# EasyEDA schematic EasyEDA_esp8266-ed_fan_2020-07-05_01-05-03.json
TITLE: Sheet_1; REV: 1.0; Date: 2020-06-21; Sheet: 1/1; Drawn By: TurtleForGaming; Company: Your Company
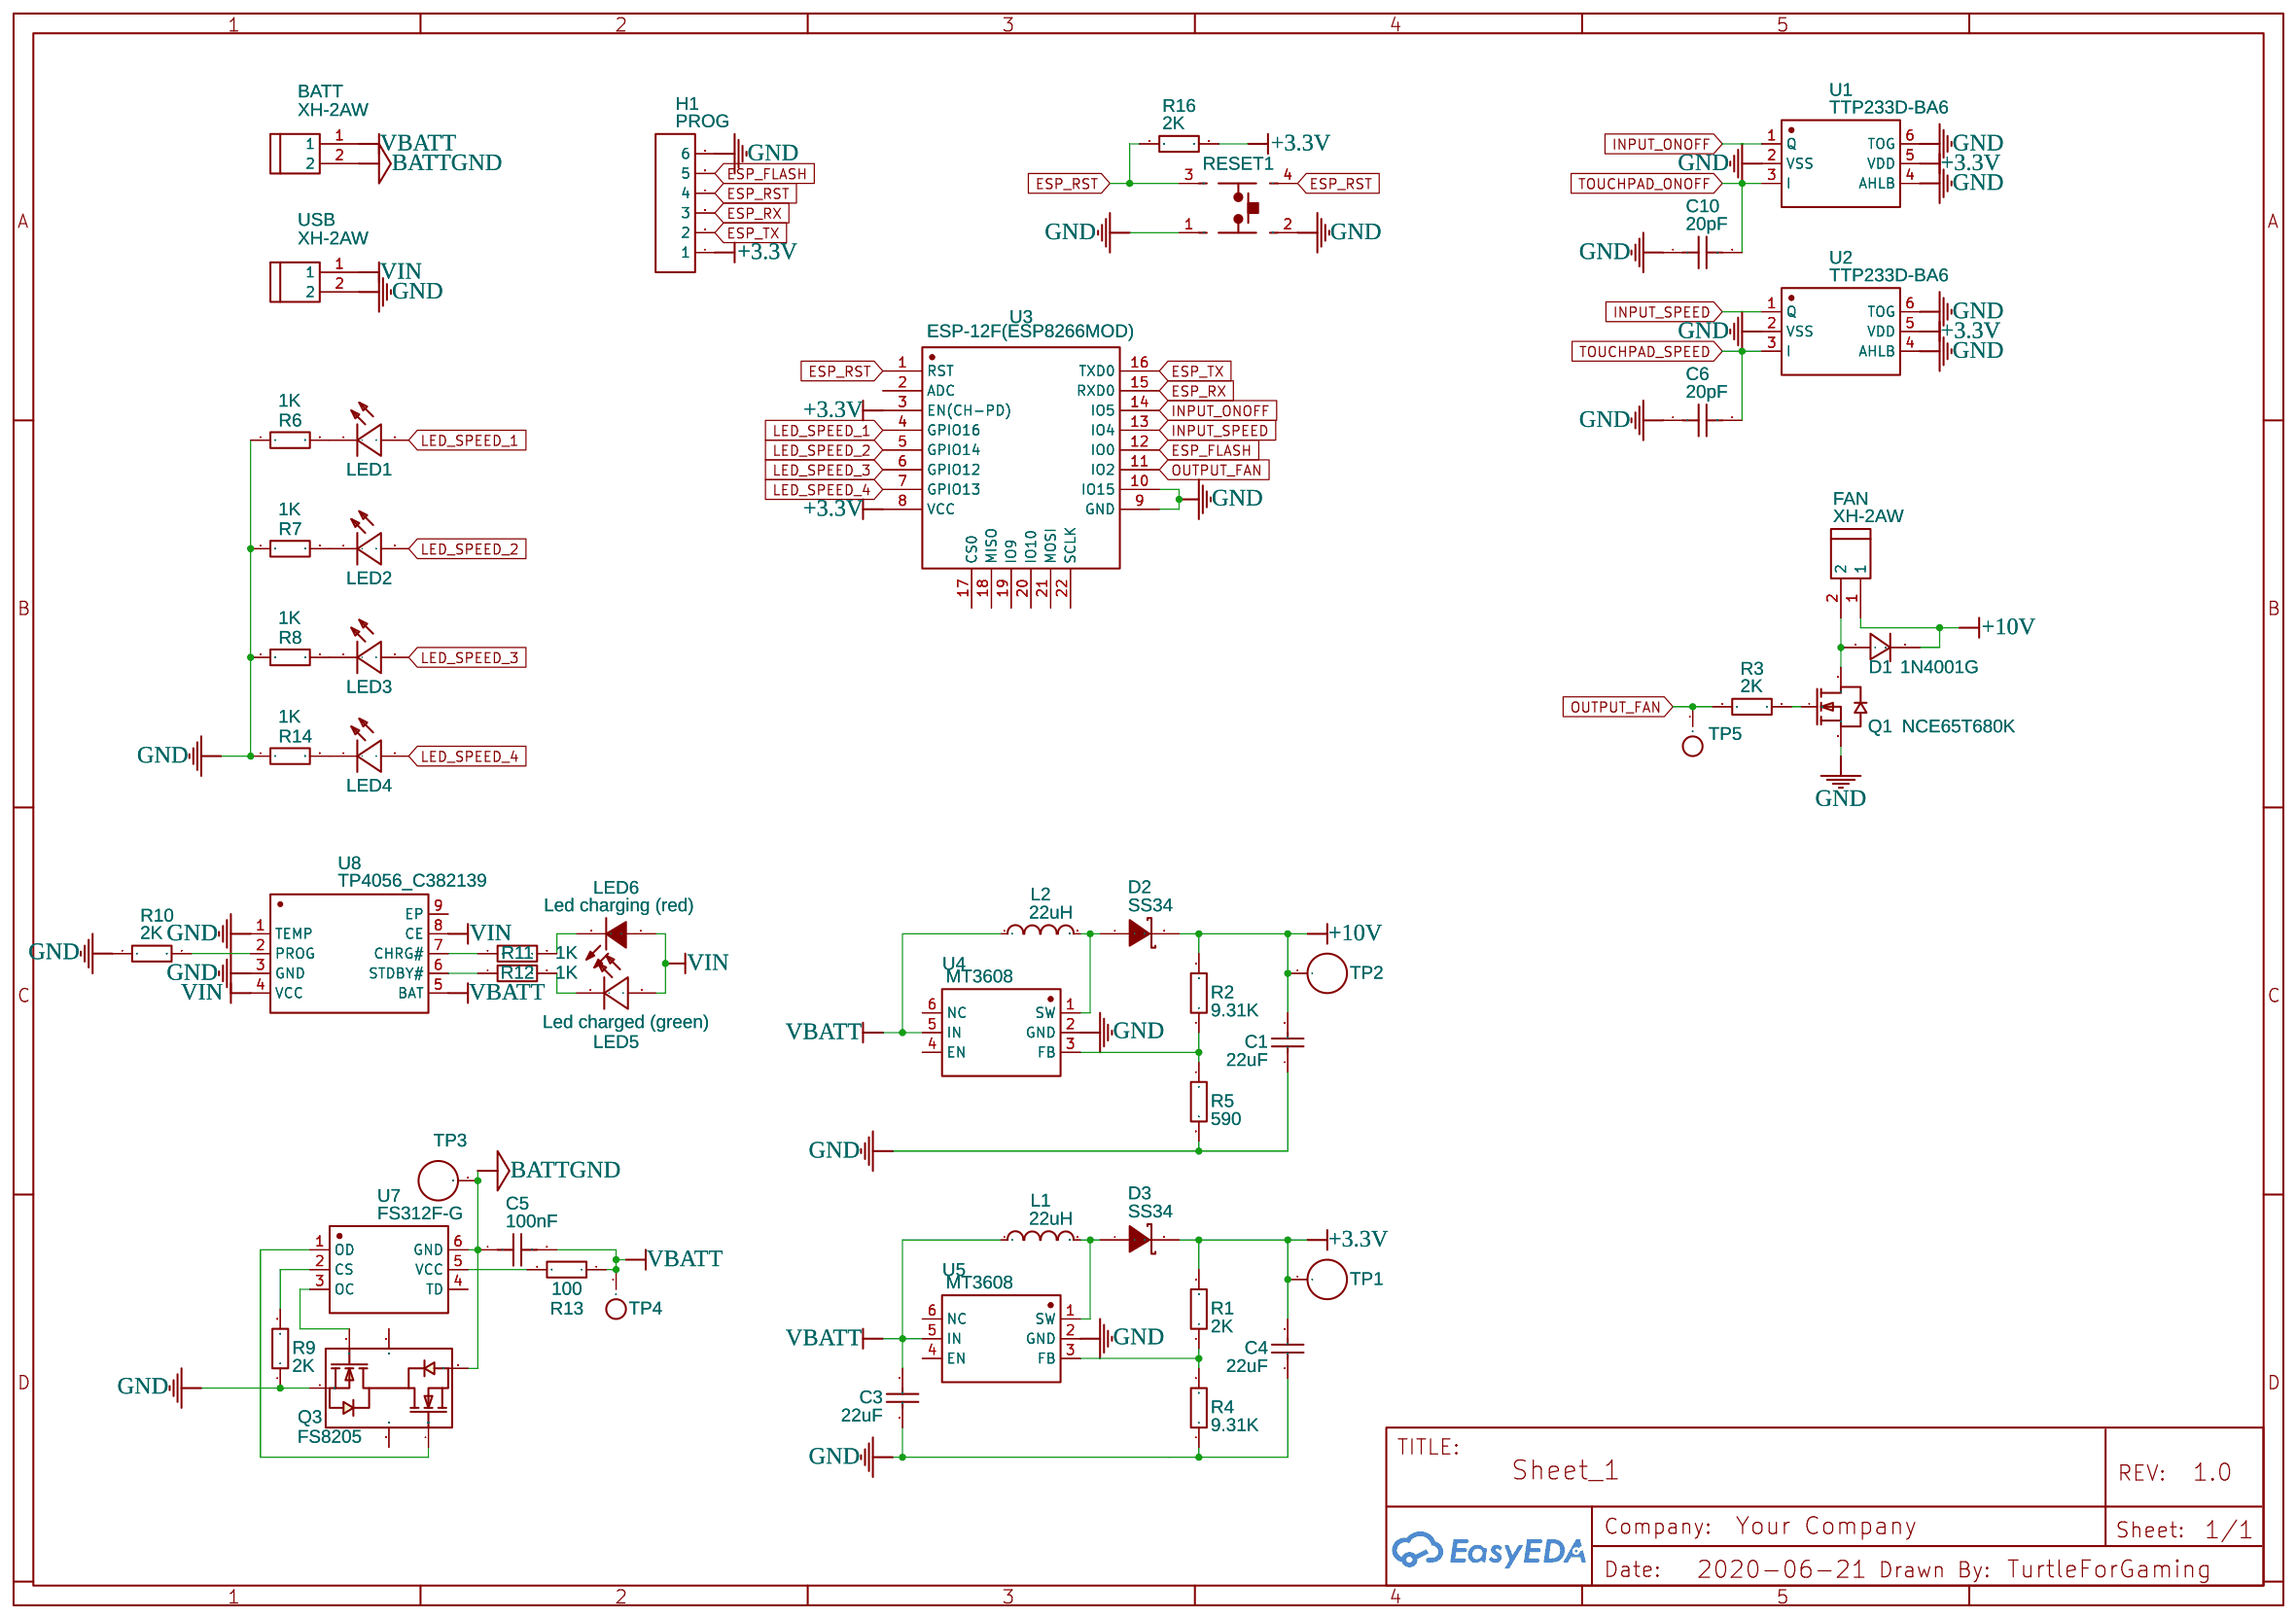
[diagram p0: schematic sheet]

## Parts
BATT  XH-2AW  [CONN-TH_2P-P2.50_XH-2AW]
C1  22uF  [1812]
C3  22uF  [1812]
C4  22uF  [1812]
C5  100nF  [C0805]
C6  20pF  [C0603]
C10  20pF  [C0603]
D1  1N4001G  [SMA_L4.4-W2.6-LS5.0-RD]
D2  SS34  [SMA(DO-214AC)]
D3  SS34  [SMA(DO-214AC)]
FAN  XH-2AW  [CONN-TH_2P-P2.50_XH-2AW]
H1  PROG  [HDR-TH_6P-P2.54-V]
L1  22uH  [7*7*4]
L2  22uH  [7*7*4]
LED1  Led charged (green)  [LED1206-RD]
LED2  Led charged (green)  [LED1206-RD]
LED3  Led charged (green)  [LED1206-RD]
LED4  Led charged (green)  [LED1206-RD]
LED5  Led charged (green)  [LED1206-RD]
LED6  Led charging (red)  [LED1206-R-RD]
Q1  NCE65T680K  [TO-252-2_L6.6-W6.1-P4.57-LS9.9-BR-CW]
Q3  FS8205  [SOT-23-6]
R1  2K  [R0805]
R2  9.31K  [R0805]
R3  2K  [R0805]
R4  9.31K  [R0805]
R5  590  [R0805]
R6  1K  [R0805]
R7  1K  [R0805]
R8  1K  [R0805]
R9  2K  [R0805]
R10  2K  [R0805]
R11  1K  [R0805]
R12  1K  [R0805]
R13  100  [R0805]
R14  1K  [R0805]
R16  2K  [R0805]
RESET1  RESET  [TACTILE SWITCH THT 6X6MM]
TP1  TEST_PAD  [TESTPAD0]
TP2  TEST_PAD  [TESTPAD0]
TP3  TEST_PAD  [TESTPAD0]
TP4  TEST_PAD  [TESTPAD0]
TP5  TEST_PAD  [TESTPAD0]
U1  TTP233D-BA6  [SOT-23-6_L2.9-W1.6-P0.95-LS2.8-BR]
U2  TTP233D-BA6  [SOT-23-6_L2.9-W1.6-P0.95-LS2.8-BR]
U3  ESP-12F(ESP8266MOD)  [WIFIM-SMD_ESP-12F-ESP8266MOD]
U4  MT3608  [SOT-23-6]
U5  MT3608  [SOT-23-6]
U7  FS312F-G  [SOT-23-6_L2.9-W1.6-P0.95-LS2.8-BR]
U8  TP4056_C382139  [ESOP-8_L4.9-W3.9-P1.27-LS6.0-BL-EP]
USB  XH-2AW  [CONN-TH_2P-P2.50_XH-2AW]

## Library data of the parts
BATT FAN USB = XH-2AW: Supplier: LCSC; Manufacturer: BOOMELE; image: //image.lceda.cn/szlcsc/C33132.jpg; Supplier Part: C33132
C1 C3 C4 = -: Voltage: 25V; Tolerance: ±10%; Supplier: LCSC; Manufacturer: FH; Manufacturer Part: 1812X226K250NT; Supplier Part: C28504
C5 = GRM21BR72A104KAC4L: Supplier: LCSC; Manufacturer: MuRata; Supplier Part: C86044
C6 C10 = 0603N200J500: Supplier: LCSC; Supplier Part: C123543; Manufacturer: Walsin Tech Corp; Contributor: LCSC
D1 = 1N4001G: Supplier: LCSC; Supplier Part: C433392; Manufacturer: Shikues; Contributor: LCSC
D2 D3 = -: Supplier: LCSC; Supplier Part: C8678
H1 = Header-Male-2.54_1x6: Supplier: LCSC; Manufacturer: BOOMELE; Supplier Part: C37208
L1 L2 = -: Supplier: LCSC; Manufacturer: LCSC; Manufacturer Part: SMRH74-220MT; Supplier Part: C27442
LED1-LED5 = led Green: Supplier: LCSC; Supplier Part: C192319
LED6 = KT-1206Red LED: Supplier: LCSC; Supplier Part: C192318
Q1 = NCE65T680K: Supplier: LCSC; Supplier Part: C216787; Manufacturer: Wuxi NCE Power Semiconductor; Contributor: LCSC
Q3 = -: Supplier: LCSC; Manufacturer: FORTUNE; Supplier Part: C32254
R1 R3 R9 R10 R16 = CR0805-FX-2001ELF: Supplier: LCSC; Supplier Part: C203834; Manufacturer: BOURNS; Contributor: LCSC
R2 R4 = RMC08059.31K1%N: Supplier: LCSC; Supplier Part: C325873; Manufacturer: Tyohm; Contributor: LCSC
R5 = CR0805F85900G: Supplier: LCSC; Manufacturer: LIZ; Supplier Part: C101801
R6-R8 R11 R12 R14 = CR0805J80102G: Supplier: LCSC; Supplier Part: C328385; Manufacturer: LIZ Elec; Contributor: LCSC
R13 = 080500F1000T5E: Supplier: LCSC; Manufacturer: UniOhm; Contributor: LCSC; Supplier Part: C146168
RESET1 = TACTILE SWITCH 6X6MM 11MM THT: Supplier Part: C393938; Supplier: LCSC; Contributor: CowboyWillT
TP1-TP5 = TEST_PAD: Manufacturer Part: TESTPAD; Contributor: wenjuntijee
U1 U2 = TTP233D-BA6: Supplier: LCSC; Manufacturer: TONTEK; Supplier Part: C82384; LCSC Assembly: Yes; SMT Type: Extend
U3 = ESP-12F(ESP8266MOD): Supplier: LCSC; Manufacturer: Ai-Thinker; Supplier Part: C82891
U4 U5 = -: Supplier: LCSC; Manufacturer: LCSC; Supplier Part: C84817
U7 = FS312F-G: Supplier: LCSC; Manufacturer: FORTUNE; image: //image.lceda.cn/szlcsc/C82736.jpg; Supplier Part: C82736; LCSC Assembly: Yes; SMT Type: Extend
U8 = TP4056_C382139: Supplier: LCSC; Supplier Part: C382139; Manufacturer: TPOWER; Manufacturer Part: TP4056; Contributor: LCSC; LCSC Assembly: Yes; SMT Type: Extend

## Nets
+3.3V: C4.2 D3.2(K) H1.1 R1.2 R16.1 TP1.1 U1.5(VDD) U2.5(VDD) U3.3(EN(CH-PD)) U3.8(VCC)
+10V: C1.2 D1.1(C) D2.2(K) FAN.1 R2.2 TP2.1
GND: C1.1 C3.1 C4.1 C6.1 C10.1 H1.6 Q1.3(S) Q3.1(S1) R4.1 R5.2 R6.1 R7.1 R8.1 R9.1 R10.1 R14.1 RESET1.1 RESET1.2 U1.2(VSS) U1.4(AHLB) U1.6(TOG) U2.2(VSS) U2.4(AHLB) U2.6(TOG) U3.9(GND) U3.10(IO15) U4.2(GND) U5.2(GND) U8.1(TEMP) U8.3(GND) USB.2
VBATT: BATT.1 C3.2 C5.2 L1.1 L2.1 R13.1 TP4.1 U4.5(IN) U5.5(IN) U8.5(BAT)
VIN: LED5.2(+) LED6.1(A) U8.4(VCC) U8.8(CE) USB.1
BATTGND: BATT.2 C5.1 Q3.3(S2) TP3.1 U7.6(GND)
ESP_FLASH: H1.5 U3.12(IO0)
ESP_RST: H1.4 R16.2 RESET1.3 RESET1.4 U3.1(RST)
ESP_RX: H1.3 U3.15(RXD0)
ESP_TX: H1.2 U3.16(TXD0)
INPUT_ONOFF: U1.1(Q) U3.14(IO5)
INPUT_SPEED: U2.1(Q) U3.13(IO4)
LED_SPEED_1: LED1.2(+) U3.4(GPIO16)
LED_SPEED_2: LED2.2(+) U3.5(GPIO14)
LED_SPEED_3: LED3.2(+) U3.6(GPIO12)
LED_SPEED_4: LED4.2(+) U3.7(GPIO13)
OUTPUT_FAN: R3.2 TP5.1 U3.11(IO2)
TOUCHPAD_ONOFF: C10.2 U1.3(I)
TOUCHPAD_SPEED: C6.2 U2.3(I)
Net-(D1-2): D1.2(A) FAN.2 Q1.2(D)
Net-(D2-1): D2.1(A) L2.2 U4.1(SW)
Net-(D3-1): D3.1(A) L1.2 U5.1(SW)
Net-(LED1-1): LED1.1(-) R6.2
Net-(LED2-1): LED2.1(-) R7.2
Net-(LED3-1): LED3.1(-) R8.2
Net-(LED4-1): LED4.1(-) R14.2
Net-(LED5-1): LED5.1(-) R12.2
Net-(LED6-2): LED6.2(K) R11.2
Net-(Q1-1): Q1.1(G) R3.1
Net-(Q3-4): Q3.4(G2) U7.1(OD)
Net-(Q3-6): Q3.6(G1) U7.3(OC)
Net-(R1-1): R1.1 R4.2 U5.3(FB)
Net-(R2-1): R2.1 R5.1 U4.3(FB)
Net-(R9-2): R9.2 U7.2(CS)
Net-(R10-2): R10.2 U8.2(PROG)
Net-(R11-1): R11.1 U8.7(CHRG#)
Net-(R12-1): R12.1 U8.6(STDBY#)
Net-(R13-2): R13.2 U7.5(VCC)

Not connected (* = marked no-connect by the designer): Q3 2(D12) 5(D12); U3 2(ADC) 17(CS0) 18(MISO) 19(IO9) 20(IO10) 21(MOSI) 22(SCLK); U4 4(EN) 6(NC); U5 4(EN) 6(NC); U7 4(TD); U8 9(EP)
